# Altium project Automatic Terrarium.PrjPcb
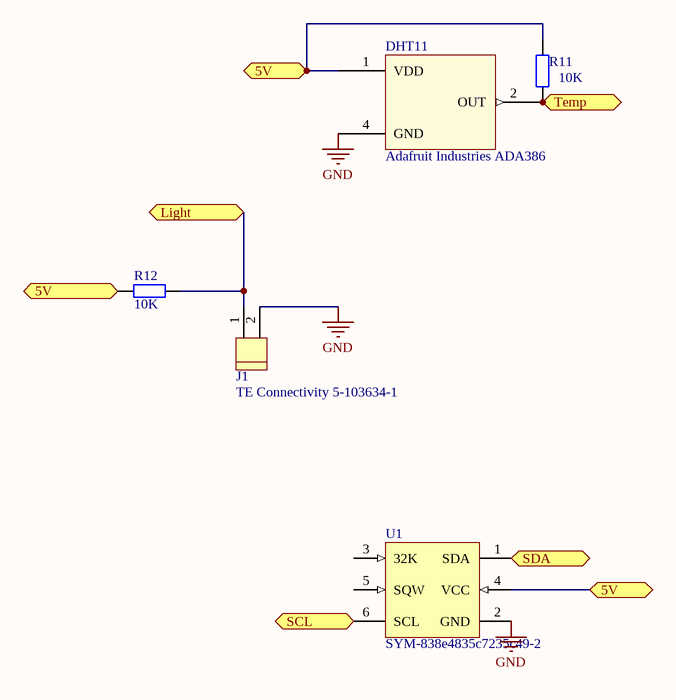
[diagram p0: Sensors.SchDoc]
1 sheet, 5 parts. Net scope: global (net labels, ports and power ports of the same name join across sheets).

## Sheet Sensors.SchDoc
size A

### Parts
DHT11  Adafruit Industries ADA386  [DHT11]
J1  TE Connectivity 5-103634-1  [PCB-uaeje0c37wq92n4bv9j3-1]
R11  Ohms: 10K  [PCB-mctr3h3tvednl0z90ud0-1]  (hidden comment: Res2)
R12  Ohms: 10K  [PCB-mctr3h3tvednl0z90ud0-1]  (hidden comment: Res2)
U1  SYM-838e4835c7235c49-2  [PCB-y0s4izvblyw4j4eze3nd-1]

### Ports
5V, Light, SCL, SDA, Temp

### Nets
GND: DHT11.4(GND) J1.2 U1.2(GND)
5V: DHT11.1(VDD) R11.2 R12.2 U1.4(VCC) ; port 5V
Light: J1.1 R12.1 ; port Light
SCL: U1.6(SCL) ; port SCL
SDA: U1.1(SDA) ; port SDA
Temp: DHT11.2(OUT) R11.1 ; port Temp

Not connected (* = marked no-connect by the designer): U1 3(32K) 5(SQW)

### Library data of the parts
DHT11 = CMP-f2473ad10e112d80-1: DHT11 basic temperature-humidity sensor + extras; Manufacturer Part Number: ADA386; OctopartID: f2473ad10e112d80; RoHS: Compliant; Octopart URL: http://octopart.com/ada386-adafruit+industries-27056432
J1 = CMP-6cb9a7e820d6b37e-1: CONN HEADER RTANG 2POS PCB TIN; Pin Pitch: 2.54 mm; ELV Compliant: Compliant; Lead-Free Status: Lead Free; Number of Contacts: 2; OctopartID: 6cb9a7e820d6b37e; Color: Black; Size-Width: 13.6 mm; Octopart URL: http://octopart.com/5-103634-1-te+connectivity-39545097; Housing Material: Thermoplastic; Number of Rows: 1; Lifecycle Status: Active; REACH SVHC Compliance: No SVHC; Size-Height: 5.08 mm; Mounting Style: Through Hole; Contact Plating: Tin; Contact Material: Brass
R11 R12 = CMP-1413dd18cda2cbd4-1: Resistor; Carbon Composition; Res 3.9 Kilohms; Pwr-Rtg 0.25 W; Tol 5%; Axial; Manufacturer Part Number: OD392JE; Power Rating: 250 mW; Lead-Free Status: Lead Free; Mounting Style: Through Hole, Axial; OctopartID: 1413dd18cda2cbd4; Resistance Tolerance: ±5%; Size-Diameter: 2.50 mm
U1 = CMP-838e4835c7235c49-3: Peripheral Module, DS3231M I2C Real-Time Clock; Manufacturer Part Number: DS3231MPMB1#; OctopartID: 838e4835c7235c49; RoHS: Exempt